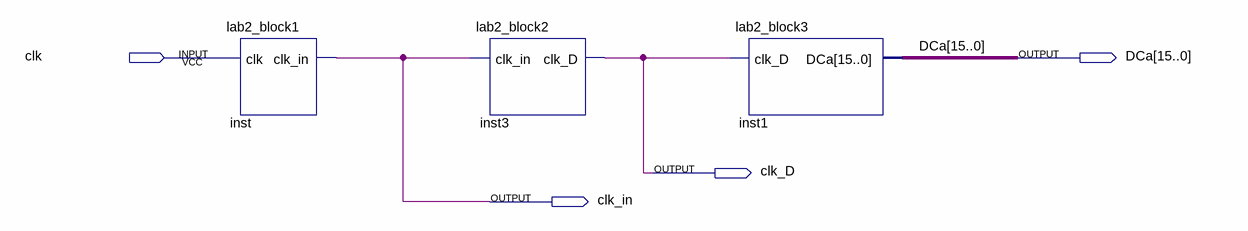
[diagram p0: schematic sheet]
// Quartus schematic lab2.bdf as structural Verilog: 3 symbols, 4 pins
module lab2 (
  input  clk,
  output [15:0] DCa,
  output clk_D,
  output clk_in
);

  lab2_block1 inst (.clk(clk), .clk_in(clk_in));
  lab2_block2 inst3 (.clk_in(clk_in), .clk_D(clk_D));
  lab2_block3 inst1 (.clk_D(clk_D), .DCa(DCa));
endmodule
